# EAGLE design Smart Fan Controler (EAGLE 9.2.0)

## Sheet 1 of 3
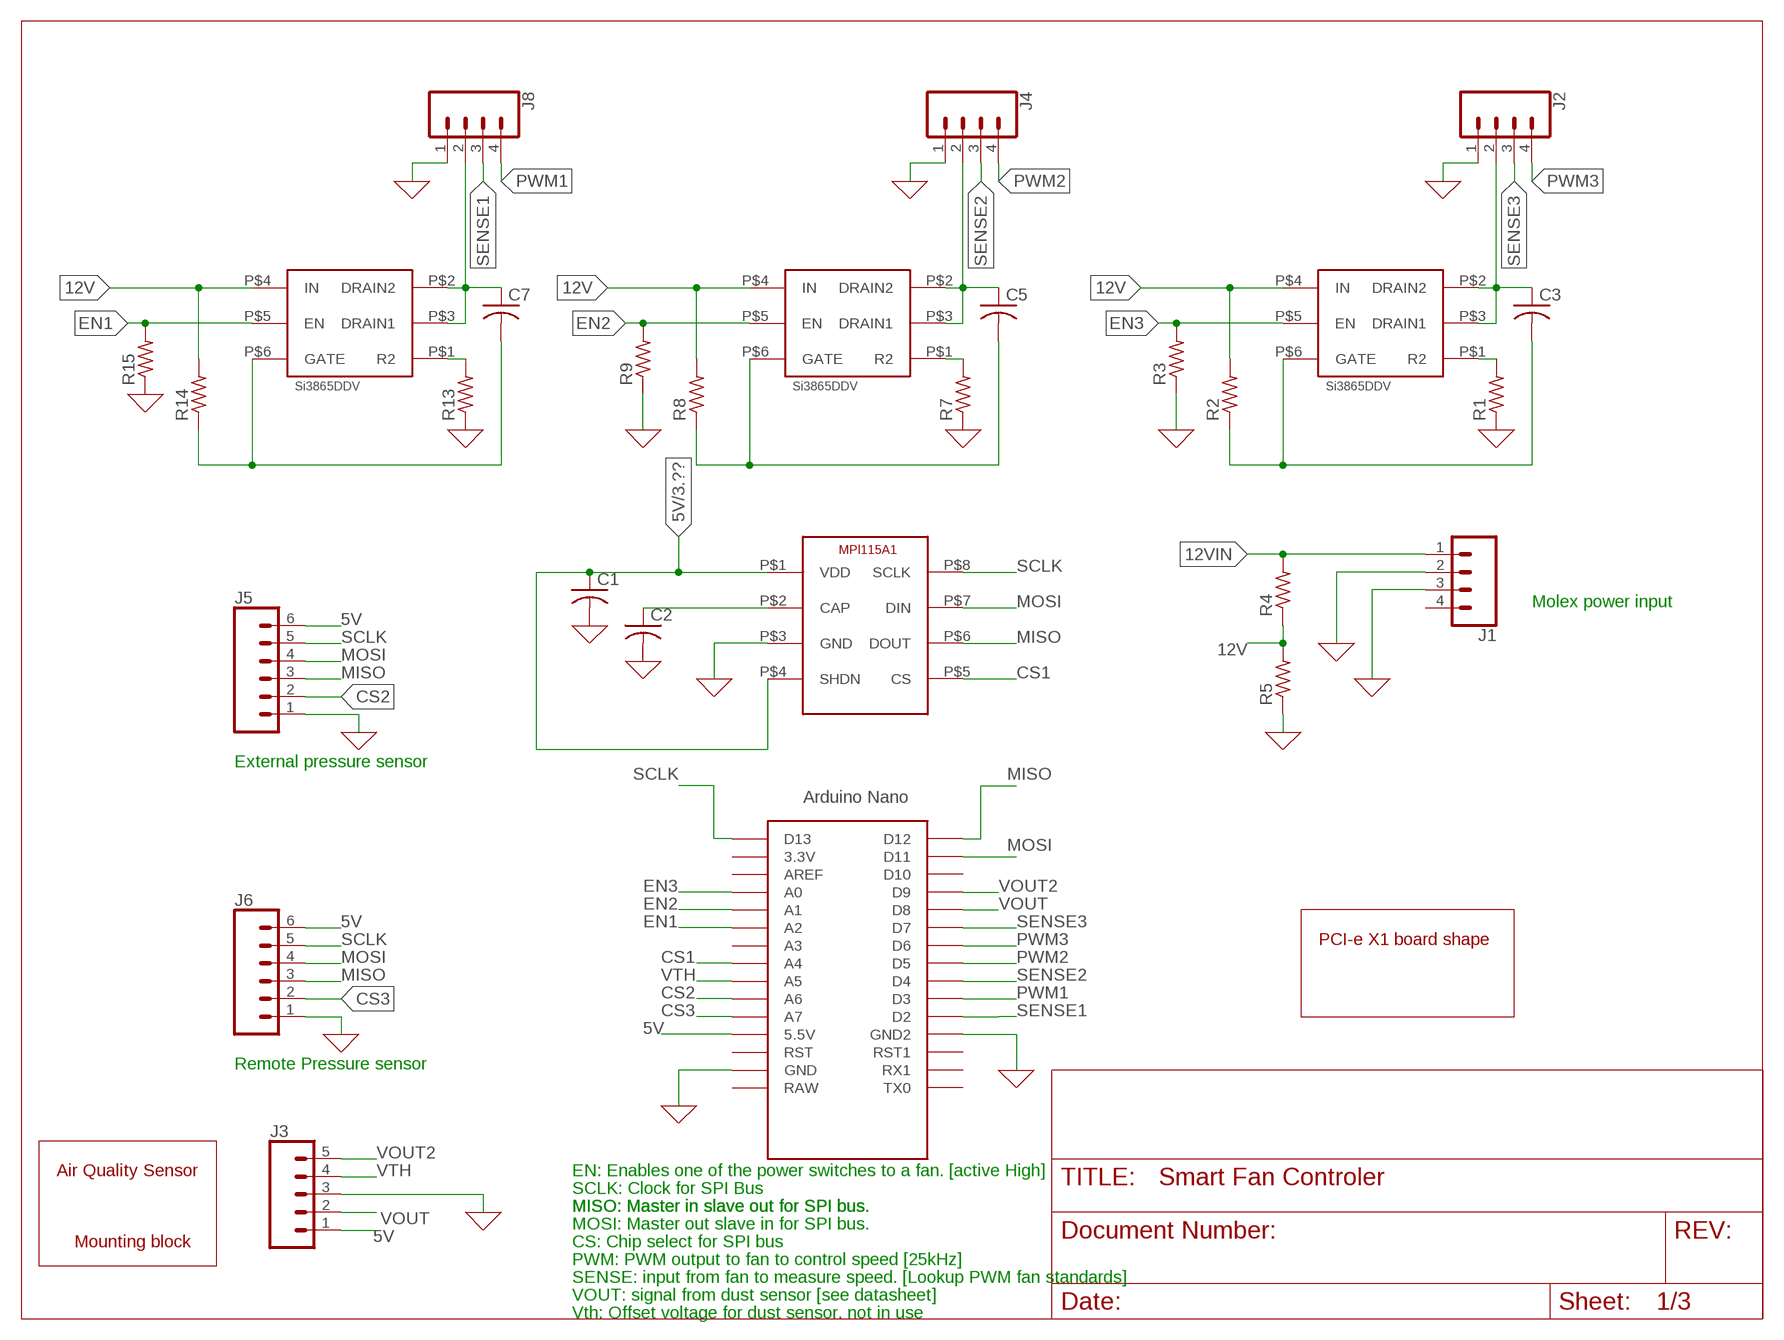
[diagram p0: schematic, sheet 1]

### Parts
C1  C-USC0805  [C0805]
C2  C-USC0805  [C0805]
C3  C-USC0805  [C0805]
C5  C-USC0805  [C0805]
C7  C-USC0805  [C0805]
J1  CONN_04MOLEX_FAN_HEADER  [MOLEX_FAN_HEADER]
J2  CONN_04MOLEX_FAN_HEADER  [MOLEX_FAN_HEADER]
J3  CONN_05NO_SILK  [1X05_NO_SILK]
J4  CONN_04MOLEX_FAN_HEADER  [MOLEX_FAN_HEADER]
J5  CONN_06LOCK_LONGPADS  [1X06_LOCK_LONGPADS]
J6  CONN_06LOCK_LONGPADS  [1X06_LOCK_LONGPADS]
J8  CONN_04MOLEX_FAN_HEADER  [MOLEX_FAN_HEADER]
R1  R-US_R0805  [R0805]
R2  R-US_R0805  [R0805]
R3  R-US_R0805  [R0805]
R4  R-US_R0805  [R0805]
R5  R-US_R0805  [R0805]
R7  R-US_R0805  [R0805]
R8  R-US_R0805  [R0805]
R9  R-US_R0805  [R0805]
R13  R-US_R0805  [R0805]
R14  R-US_R0805  [R0805]
R15  R-US_R0805  [R0805]
U$1  MPL115A1  [MPL115A1]
U$2  NANO  [NANO]
U$3  SI3865DDV  [TSOP-6]
U$4  AIR_QUALITY_SENSOR  [AIR_SENSOR]
U$5  SI3865DDV  [TSOP-6]
U$8  SI3865DDV  [TSOP-6]

### Nets
0: C1.2 C2.2 J1.2 J1.3 J2.1 J3.3 J4.1 J5.1 J6.1 J8.1 R1.1 R3.1 R5.1 R7.1 R9.1 R13.1 R15.1 U$1.P$3(GND) U$2.GND U$2.GND1(GND2) ; supply symbol labelled GND ; also sheet 3
5V: C1.1 J3.1 J5.6 J6.6 U$1.P$1(VDD) U$1.P$4(SHDN) U$2.5V(5.5V) ; also sheet 3
12V: R2.2 R4.1 R5.2 R8.2 R14.2 U$3.P$4(IN) U$5.P$4(IN) U$8.P$4(IN)
12VIN: J1.1 R4.2
CS1: U$1.P$5(CS) U$2.A4
CS2: J5.2 U$2.A6
CS3: J6.2 U$2.A7
EN1: R15.2 U$2.A2 U$8.P$5(EN)
EN2: R9.2 U$2.A1 U$5.P$5(EN)
EN3: R3.2 U$2.A0 U$3.P$5(EN)
MISO: J5.3 J6.3 U$1.P$6(DOUT) U$2.D12 ; also sheet 3
MOSI: J5.4 J6.4 U$1.P$7(DIN) U$2.D11 ; also sheet 3
N$1: C2.1 U$1.P$2(CAP)
N$2: R1.2 U$3.P$1(R2)
N$10: R7.2 U$5.P$1(R2)
N$11: C3.1 J2.2 U$3.P$2(DRAIN2) U$3.P$3(DRAIN1)
N$19: C3.2 R2.1 U$3.P$6(GATE)
N$20: C5.1 J4.2 U$5.P$2(DRAIN2) U$5.P$3(DRAIN1)
N$21: C5.2 R8.1 U$5.P$6(GATE)
N$25: R13.2 U$8.P$1(R2)
N$26: C7.1 J8.2 U$8.P$2(DRAIN2) U$8.P$3(DRAIN1)
N$27: C7.2 R14.1 U$8.P$6(GATE)
PWM1: J8.4 U$2.D3
PWM2: J4.4 U$2.D5
PWM3: J2.4 U$2.D6
SCLK: J5.5 J6.5 U$1.P$8(SCLK) U$2.D13 ; also sheet 3
SENSE1: J8.3 U$2.D2
SENSE2: J4.3 U$2.D4
SENSE3: J2.3 U$2.D7
VOUT: J3.2 U$2.D8
VOUT2: J3.5 U$2.D9
VTH: J3.4 U$2.A5
Unconnected: J1.4 U$2.3.3V U$2.A3 U$2.AREF U$2.D10 U$2.ICSP1 U$2.ICSP2 U$2.ICSP3 U$2.ICSP4 U$2.ICSP5 U$2.ICSP6 U$2.RAW U$2.RST U$2.RST1 U$2.RX1 U$2.TX0

### Notes on the sheet
- Molex power input
- External pressure sensor
- PCI-e X1 board shape
- Remote Pressure sensor
- EN: Enables one of the power switches to a fan. [active High]
- SCLK: Clock for SPI Bus
- MISO: Master in slave out for SPI bus. | MISO: Master in slave out for SPI bus.
- MOSI: Master out slave in for SPI bus.
- CS: Chip select for SPI bus
- PWM: PWM output to fan to control speed [25kHz]
- SENSE: input from fan to measure speed. [Lookup PWM fan standards]
- VOUT: signal from dust sensor [see datasheet]
- Vth: Offset voltage for dust sensor. not in use

## Sheet 2 of 3

## Sheet 3 of 3
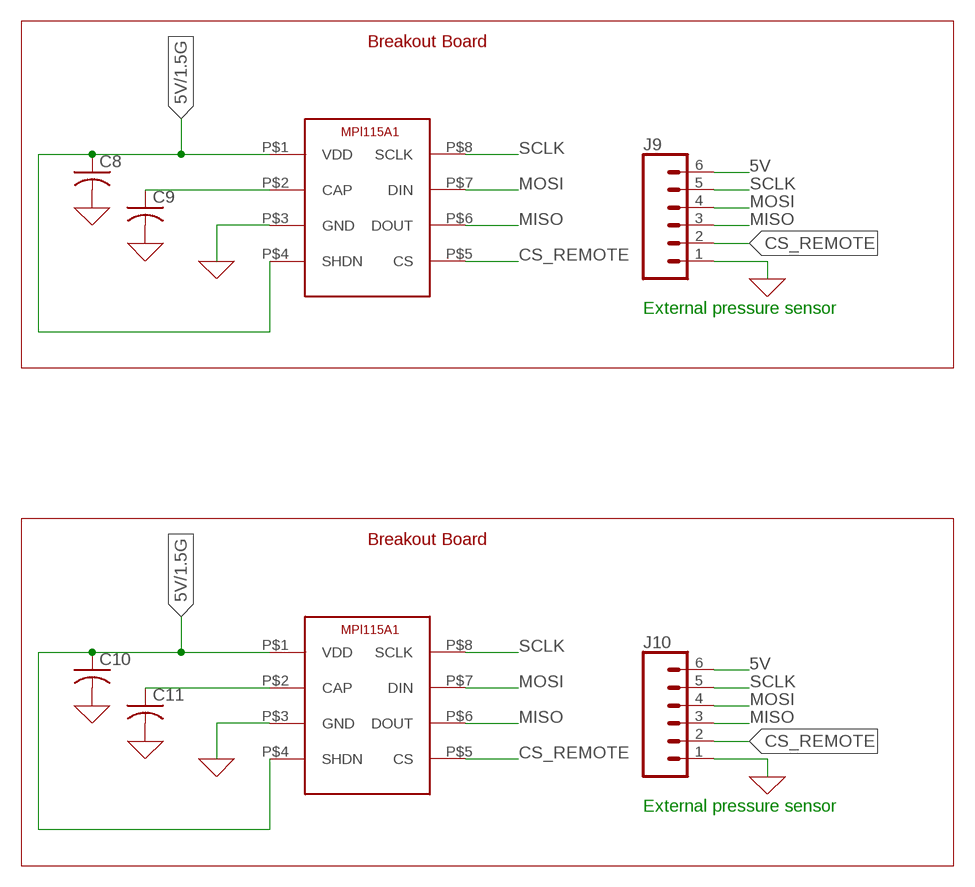
[diagram p1: schematic, sheet 3]

### Parts
C8  C-USC0805  [C0805]
C9  C-USC0805  [C0805]
C10  C-USC0805  [C0805]
C11  C-USC0805  [C0805]
J9  CONN_06LOCK_LONGPADS  [1X06_LOCK_LONGPADS]
J10  CONN_06LOCK_LONGPADS  [1X06_LOCK_LONGPADS]
U$7  MPL115A1  [MPL115A1]
U$9  MPL115A1  [MPL115A1]

### Nets
0: C8.2 C9.2 C10.2 C11.2 J9.1 J10.1 U$7.P$3(GND) U$9.P$3(GND) ; supply symbol labelled GND ; also sheet 1
5V: C8.1 C10.1 J9.6 J10.6 U$7.P$1(VDD) U$7.P$4(SHDN) U$9.P$1(VDD) U$9.P$4(SHDN) ; also sheet 1
CS_REMOTE: J9.2 J10.2 U$7.P$5(CS) U$9.P$5(CS)
MISO: J9.3 J10.3 U$7.P$6(DOUT) U$9.P$6(DOUT) ; also sheet 1
MOSI: J9.4 J10.4 U$7.P$7(DIN) U$9.P$7(DIN) ; also sheet 1
N$4: C9.1 U$7.P$2(CAP)
N$5: C11.1 U$9.P$2(CAP)
SCLK: J9.5 J10.5 U$7.P$8(SCLK) U$9.P$8(SCLK) ; also sheet 1

### Notes on the sheet
- Breakout Board
- External pressure sensor
- Breakout Board
- External pressure sensor

## Library data of the parts
C1-C3 C5 C7-C11 = rcl:C-US: CAPACITOR, American symbol; SPICEPREFIX: C
J1 J2 J4 J8 = Smart fan:CONN_04: Multi connection point. Often used as Generic Header-pin footprint for 0.1 inch spaced/style header connections On any of the 0.1 inch spaced packages, you can populate with these: Break Away Headers - Straight <https://www.sparkfun.com/products/116> (PRT-00116) Break Away Male Headers - Right Angle <https://www.sparkfun.com/products/553> (PRT-00553) Female Headers <https://www.sparkfun.com/products/115> (PRT-00115) Break Away Headers - Machine Pin <https://www.sparkfun.com/products/117> (PRT-00117) Break Away Female Headers - Swiss Machine Pin <https://www.sparkfun.com/products/743> (PRT-00743) For SCREWTERMINALS and SPRING TERMINALS visit here: Screw Terimnals on SparkFun.com <https://www.sparkfun.com/search/results?term=Screw+Terminals> (5mm/3.5mm/2.54mm spacing) This device is also useful as a general connection point to wire up your design to another part of your project. Our various solder wires solder well into these plated through hole pads. Hook-Up Wire - Assortment (Stranded, 22 AWG) <https://www.sparkfun.com/products/11375> (PRT-11375) Hook-Up Wire - Assortment (Solid Core, 22 AWG) <https://www.sparkfun.com/products/11367> (PRT-11367) View the entire wire category on our website here <https://www.sparkfun.com/categories/141> Special notes: Molex polarized connector foot print use with SKU : PRT-08231 with associated crimp pins and housings. 1MM SMD Version SKU: PRT-10208
J3 = SparkFun-Connectors:CONN_05: Multi connection point. Often used as Generic Header-pin footprint for 0.1 inch spaced/style header connections On any of the 0.1 inch spaced packages, you can populate with these: Break Away Headers - Straight <https://www.sparkfun.com/products/116> (PRT-00116) Break Away Male Headers - Right Angle <https://www.sparkfun.com/products/553> (PRT-00553) Female Headers <https://www.sparkfun.com/products/115> (PRT-00115) Break Away Headers - Machine Pin <https://www.sparkfun.com/products/117> (PRT-00117) Break Away Female Headers - Swiss Machine Pin <https://www.sparkfun.com/products/743> (PRT-00743) For SCREWTERMINALS and SPRING TERMINALS visit here: Screw Terimnals on SparkFun.com <https://www.sparkfun.com/search/results?term=Screw+Terminals> (5mm/3.5mm/2.54mm spacing) This device is also useful as a general connection point to wire up your design to another part of your project. Our various solder wires solder well into these plated through hole pads. Hook-Up Wire - Assortment (Stranded, 22 AWG) <https://www.sparkfun.com/products/11375> (PRT-11375) Hook-Up Wire - Assortment (Solid Core, 22 AWG) <https://www.sparkfun.com/products/11367> (PRT-11367) View the entire wire category on our website here <https://www.sparkfun.com/categories/141> Special notes: Molex polarized connector foot print use with SKU : PRT-08231 with associated crimp pins and housings. 1MM SMD Version SKU: PRT-10208
J5 J6 J9 J10 = SparkFun-Connectors:CONN_06: Multi connection point. Often used as Generic Header-pin footprint for 0.1 inch spaced/style header connections On any of the 0.1 inch spaced packages, you can populate with these: Break Away Headers - Straight <https://www.sparkfun.com/products/116> (PRT-00116) Break Away Male Headers - Right Angle <https://www.sparkfun.com/products/553> (PRT-00553) Female Headers <https://www.sparkfun.com/products/115> (PRT-00115) Break Away Headers - Machine Pin <https://www.sparkfun.com/products/117> (PRT-00117) Break Away Female Headers - Swiss Machine Pin <https://www.sparkfun.com/products/743> (PRT-00743) Arduino Stackable Header - 6 Pin <https://www.sparkfun.com/products/9280> (PRT-09280) For SCREWTERMINALS and SPRING TERMINALS visit here: Screw Terimnals on SparkFun.com <https://www.sparkfun.com/search/results?term=Screw+Terminals> (5mm/3.5mm/2.54mm spacing) This device is also useful as a general connection point to wire up your design to another part of your project. Our various solder wires solder well into these plated through hole pads. Hook-Up Wire - Assortment (Stranded, 22 AWG) <https://www.sparkfun.com/products/11375> (PRT-11375) Hook-Up Wire - Assortment (Solid Core, 22 AWG) <https://www.sparkfun.com/products/11367> (PRT-11367) View the entire wire category on our website here <https://www.sparkfun.com/categories/141>
R1-R5 R7-R9 R13-R15 = rcl:R-US_: RESISTOR, American symbol; SPICEPREFIX: R
U$1 U$7 U$9 = Smart fan:MPL115A1
U$2 = Smart fan:NANO: Arduino Nano
U$3 U$5 U$8 = DubSat1 Components:SI3865DDV
U$4 = Smart fan:AIR_QUALITY_SENSOR

## Board
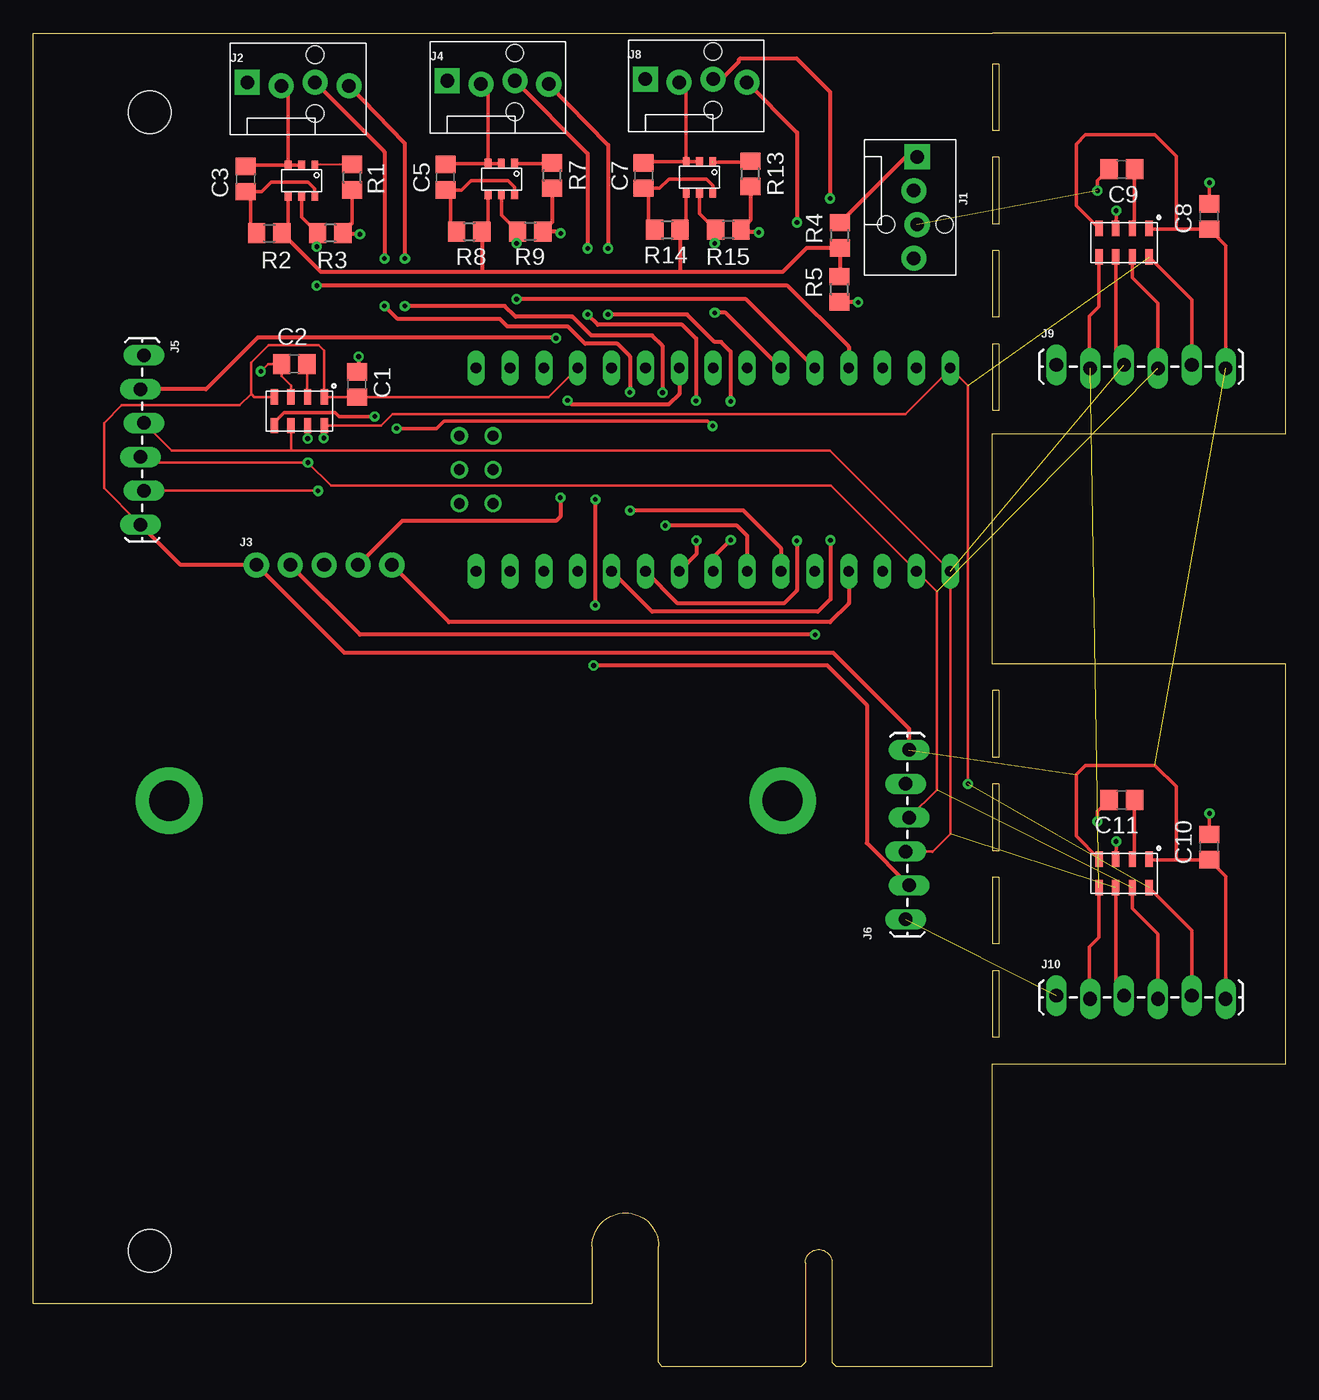
[diagram p2: board, top side]
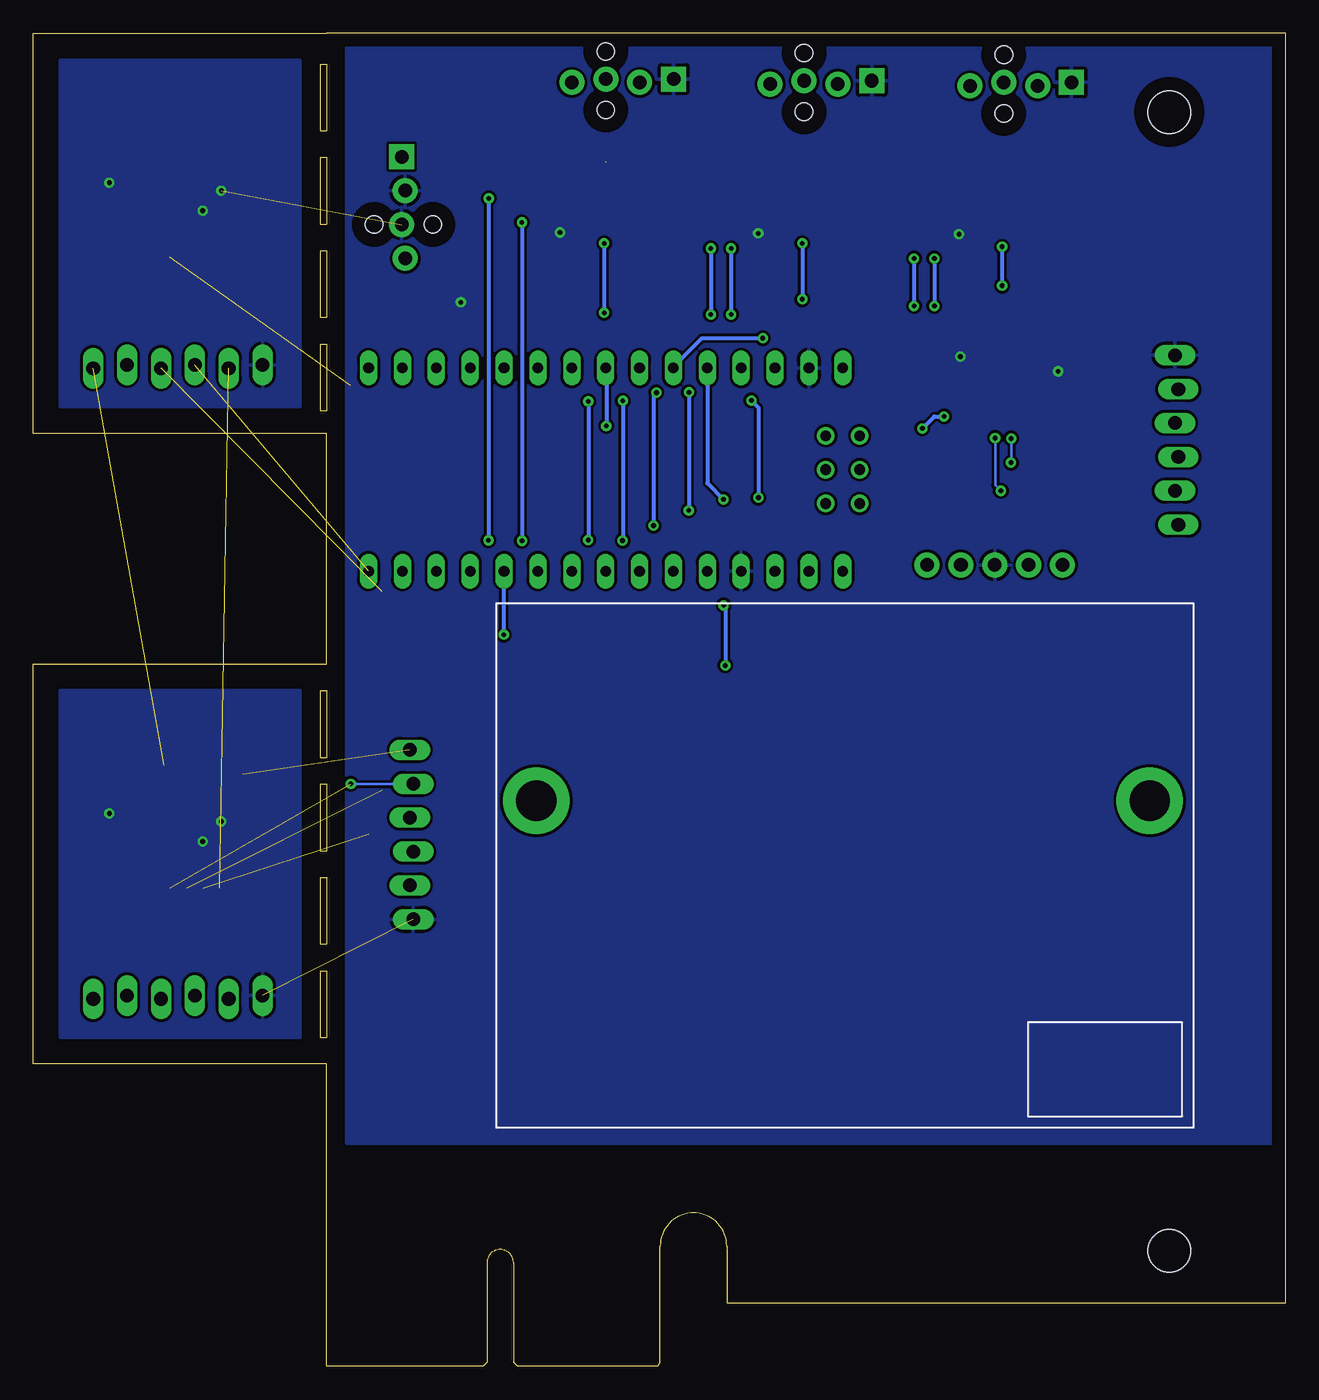
[diagram p3: board, bottom side, seen from below]

Size 93.91 x 99.95 mm. Coordinates in mm from the lower left corner, seen from the top.
Outline: 0,4.7 0,99.95 71.91,99.95 93.91,99.95 93.91,69.95 71.91,69.95 71.91,52.66 93.91,52.66 93.91,22.65 71.91,22.65 71.91,0 60.2,0 59.9,0.3 59.9,7.75 arc180 57.9,7.75 57.9,0.3 57.6,0 47.1,0 46.9,0.3 46.9,9 arc90 44.4,11.5 arc90 41.9,9 41.9,4.7 0,4.7
Outline: 0,4.7 0,4.7
Outline: 72.41,29.65 72.41,24.65 71.91,24.65 71.91,29.65 72.41,29.65
Outline: 72.41,36.66 72.41,31.65 71.91,31.65 71.91,36.66 72.41,36.66
Outline: 72.41,43.66 72.41,38.66 71.91,38.66 71.91,43.66 72.41,43.66
Outline: 72.41,50.66 72.41,45.66 71.91,45.66 71.91,50.66 72.41,50.66
Outline: 72.41,76.66 72.41,71.66 71.91,71.66 71.91,76.66 72.41,76.66
Outline: 72.41,83.66 72.41,78.66 71.91,78.66 71.91,83.66 72.41,83.66
Outline: 72.41,90.66 72.41,85.66 71.91,85.66 71.91,90.66 72.41,90.66
Outline: 72.41,97.66 72.41,92.66 71.91,92.66 71.91,97.66 72.41,97.66
Copper layers (1*16): Top 0.035mm / dielectric 1.5mm / Bottom 0.035mm
Design rules "default *": minimum track width 6mil, minimum drill 0.35mm, track to track 8mil, track to pad 8mil, pad to pad 6mil, via to via 6mil, smd to smd 6mil, copper to edge 40mil, drill to drill 6mil, minimum pad ring 10mil, minimum via ring 8mil, stop-mask expansion 4mil, vias tented up to drill 0mil, thermal gap 10mil
Holes 3.2 mm at 8.72,8.66 8.72,94.06

### Footprints (pad centres in the part's own frame; a part is rotated, then mirrored left to right if it is on the bottom)
C0805 = smd 1.3 x 1.5: 1 -0.95,0; 2 0.95,0
MOLEX_FAN_HEADER = drill 1.016 pad 1.88 square: 1 0,0.127 | drill 1.016 pad 1.88: 2 2.54,-0.127; 3 5.08,0.127; 4 7.62,-0.127 | hole 1.3: 5.08,2.2; 5.08,-2.2
1X05_NO_SILK = drill 1.016 pad 1.88: 1 0,0; 2 2.54,0; 3 5.08,0; 4 7.62,0; 5 10.16,0
1X06_LOCK_LONGPADS = drill 1.016 long: 1 0,0; 2 2.54,-0.254; 3 5.08,0; 4 7.62,-0.254; 5 10.16,0; 6 12.7,-0.254
R0805 = smd 1.3 x 1.5: 1 -0.95,0; 2 0.95,0
MPL115A1 = smd 1.15 x 0.55: P$1 -1.075,1.875; P$2 -1.075,0.625; P$3 -1.075,-0.625; P$4 -1.075,-1.875; P$5 1.075,-1.875; P$6 1.075,-0.625; P$7 1.075,0.625; P$8 1.075,1.875
NANO = drill 0.8 long: 3.3V -10.16,24.13; 5V -10.16,-1.27; A0 -10.16,19.05; A1 -10.16,16.51; A2 -10.16,13.97; A3 -10.16,11.43; A4 -10.16,8.89; A5 -10.16,6.35; A6 -10.16,3.81; A7 -10.16,1.27; AREF -10.16,21.59; D2 5.08,1.27; D3 5.08,3.81; D4 5.08,6.35; D5 5.08,8.89; D6 5.08,11.43; D7 5.08,13.97; D8 5.08,16.51; D9 5.08,19.05; D10 5.08,21.59; D11 5.08,24.13; D12 5.08,26.67; D13 -10.16,26.67; GND -10.16,-6.35; GND1 5.08,-1.27; RAW -10.16,-8.89; RST -10.16,-3.81; RST1 5.08,-3.81; RX1 5.08,-6.35; TX0 5.08,-8.89 | drill 0.8: ICSP1 -5.08,-10.16; ICSP2 -5.08,-7.62; ICSP3 -2.54,-10.16; ICSP4 -2.54,-7.62; ICSP5 0,-10.16; ICSP6 0,-7.62
TSOP-6 = smd 0.508 x 0.7: P$1 -1,-1.162; P$2 0,-1.162; P$3 1,-1.162; P$4 1,1.162; P$5 0,1.162; P$6 -1,1.162
AIR_SENSOR = drill 3 pad 5: P$1 3,24.5; P$2 49,24.5

### Placement (x,y rotation side)
C1  24.28,73.63 90 top
C2  19.57,75.16 180 top
C3  15.92,89.03 270 top
C5  30.91,89.16 270 top
C7  45.77,89.29 270 top
C8  88.18,86.22 90 top
C9  81.63,89.76 180 top
C10  88.18,38.93 90 top
C11  81.63,42.47 180 top
J1  66.15,90.7 270 top
J2  16.05,96.14 0 top
J3  16.73,60.09 0 top
J4  31.04,96.27 0 top
J5  8.3,75.81 270 top
J6  65.42,33.52 90 top
J8  45.89,96.4 0 top
J9  76.72,75.09 0 top
J10  76.72,27.79 0 top
R1  23.92,89.16 90 top
R2  17.7,84.97 0 top
R3  22.27,84.97 180 top
R4  60.48,84.81 90 top
R5  60.46,80.76 90 top
R7  38.91,89.29 90 top
R8  32.69,85.09 0 top
R9  37.26,85.09 180 top
R13  53.77,89.41 90 top
R14  47.55,85.22 0 top
R15  52.12,85.22 180 top
U$1  19.95,71.61 270 top
U$2  42.1,64.7 270 top
U$3  20.11,88.91 180 top
U$4  59.19,17.9 0 bottom
U$5  35.1,89.03 180 top
U$7  81.8,84.25 270 top
U$8  49.96,89.16 180 top
U$9  81.8,36.96 270 top

### Tracks (layer width: path | path; a pad name or v marks a point on that pad's centre or on a via)
0  (via drill 0.35)  (2 unrouted)
  Top 0.2: U$1.P$3 19.32,73.53 18.62,74.24 C2.2 17.62,75.16 v17.06,74.61
  Top 0.254: R3.1 arc-90 23.92,85.67 R1.1 | C8.2 88.18,88.75 v88.21,88.75 | C9.2 79.81,88.89 v79.81,88.15 | v81.21,86.65 U$7.P$3 | C10.2 88.18,41.46 v88.21,41.46 | C11.2 79.81,41.6 v79.81,40.86 | v81.21,39.36 U$9.P$3
  Top 0.305: R13.1 53.77,85.92 R15.1 53.26,85.03 v54.41,85.03 | R7.1 38.91,85.8 R9.1 39.41,85.09 v39.55,84.95 | R3.1 23.29,84.89 v24.49,84.89 | R5.1 60.48,79.78 v61.85,79.78 | C1.2 24.39,74.69 v24.39,75.72
  pour Bottom: -2.11,101.1 70.41,101.1 70.41,16.71 -2.11,16.71
  pour Bottom: 73.91,71.95 91.91,71.95 91.91,97.95 73.91,97.95
  pour Bottom: 73.91,24.65 91.91,24.65 91.91,50.66 73.91,50.66
5V  (2 unrouted)
  Top 0.2: U$2.5V 38.65,72.68 C1.1 21.85,72.68 21.84,72.68 U$1.P$1 21.82,76.14 21.41,76.56 17.64,76.56 16.34,75.26 16.34,72.92 | 16.34,72.92 16.34,72.87 16.36,72.89 16.56,72.68 U$1.P$4 | J5.6 7.84,63.31 5.3,65.85 5.3,70.72 6.64,72.06 15.48,72.06 16.34,72.92
  Top 0.254: J9.6 89.42,84.03 C8.1 85.81,85.27 | 85.81,85.27 83.73,85.27 U$7.P$1 | U$7.P$4 78.21,87.04 78.21,91.65 78.91,92.35 84.11,92.35 85.71,90.75 85.71,85.37 85.81,85.27 | J10.6 89.42,36.73 C10.1 85.81,37.98 | 85.81,37.98 83.73,37.98 U$9.P$1 | U$9.P$4 78.21,39.75 78.21,44.36 78.91,45.05 84.11,45.05 85.71,43.46 85.71,38.08 85.81,37.98
  Top 0.305: 7.84,63.31 11.06,60.09 J3.1 23.33,53.48 60,53.48 65.68,47.81 J6.6
12V
  Top 0.203: 19.11,85.43 arc90 R2.2 | 34.1,85.56 arc90 R8.2 | 48.96,85.69 arc90 R14.2
  Top 0.254: U$3.P$4 19.11,85.43 | U$5.P$4 34.1,85.56 | U$8.P$4 48.96,85.69
  Top 0.305: 48.56,82.05 56.18,82.05 57.99,83.86 R4.1 60.48,81.73 R5.2 | 48.56,82.05 33.58,82.05 | 33.58,82.05 21.57,82.05 R2.2 | R14.2 48.49,82.11 48.56,82.05 | R8.2 33.64,82.11 33.58,82.05
12VIN
  Top 0.305: R4.2 65.42,90.7 J1.1
CS1  (via drill 0.35)
  Top 0.254: U$1.P$5 18.07,70.75 18.82,71.51 22.64,71.51 22.92,71.23 v25.61,71.23 | v27.24,70.33 30.24,70.33 30.79,70.88 50.57,70.88 v50.94,70.51
  Bottom 0.305: v25.61,71.23 26.34,71.23 v27.24,70.33 | v50.94,70.51 50.94,74.81 U$2.A4
CS2  (via drill 0.35)
  Top 0.305: J5.2 12.96,73.27 16.84,77.14 39.15,77.14 v39.2,77.09
  Bottom 0.305: v39.2,77.09 43.77,77.09 45.91,74.95 U$2.A6
CS3  (via drill 0.35)
  Top 0.305: J6.2 62.51,39.22 62.51,49.59 59.55,52.55 v42.01,52.55 | v42.14,57.05 42.14,64.98 v42.15,65
  Bottom 0.305: v42.01,52.55 42.01,56.93 v42.14,57.05 | v42.15,65 43.37,66.21 U$2.A7
CS_REMOTE  (1 unrouted)
  Top 0.254: U$7.P$5 79.92,79.47 79.21,78.75 79.21,74.89 J9.2 | U$9.P$5 79.92,32.17 79.21,31.45 79.21,27.59 J10.2
EN1  (via drill 0.35)
  Top 0.254: R15.2 49.96,86.43 U$8.P$5
  Top 0.305: R15.2 51.17,84.27 v51.1,84.21 | v51.1,79 51.92,79 U$2.A2
  Bottom 0.305: v51.1,84.21 v51.1,79
EN2  (via drill 0.35)
  Top 0.254: R9.2 35.1,86.3 U$5.P$5
  Top 0.305: R9.2 36.31,84.27 v36.24,84.21 | U$2.A1 53.45,80.02 v36.24,80.02
  Bottom 0.305: v36.24,84.21 v36.24,80.02
EN3  (via drill 0.35)
  Top 0.254: R3.2 20.11,86.18 U$3.P$5
  Top 0.305: R3.2 21.26,84.9 v21.26,83.95 | v21.26,81.03 56.57,81.03 61.15,76.46 U$2.A0
  Bottom 0.305: v21.26,83.95 v21.26,81.03
MISO  (2 unrouted)
  Top 0.2: J5.3 10.37,68.66 19.35,68.66 | 19.35,68.66 59.73,68.66 U$2.D12 68.77,39.91 67.43,38.58 67.41,38.6 J6.3 | 19.35,68.66 19.35,70.51 U$1.P$6
  Top 0.254: U$7.P$6 81.17,75.72 J9.3 | U$9.P$6 81.17,28.42 J10.3
MOSI  (via drill 0.35)  (2 unrouted)
  Top 0.2: J5.4 8.47,67.76 v20.59,67.76 22.32,66.03 59.81,66.03 U$2.D11 67.76,58.08 67.76,43.22 J6.4 | U$1.P$7 v20.57,69.57 v20.57,69.56
  Top 0.254: U$7.P$7 82.42,81.64 84.34,79.72 J9.4 | U$9.P$7 82.42,34.34 84.34,32.43 J10.4
  Bottom 0.2: v20.57,69.56 20.57,67.78 v20.59,67.76
N$1
  Top 0.2: C2.1 20.52,72.74 U$1.P$2
N$2
  Top 0.152: R1.2 21.15,90.11 U$3.P$1
  Top 0.254: R1.2 23.88,90.07
N$4
  Top 0.254: U$7.P$2 82.58,85.48 C9.1
N$5
  Top 0.254: U$9.P$2 82.58,38.19 C11.1
N$10
  Top 0.254: U$5.P$1 38.87,90.19 R7.2
N$11
  Top 0.203: 19.11,95.37 J2.2
  Top 0.254: U$3.P$2 U$3.P$3 | 19.11,95.37 U$3.P$3 | U$3.P$3 16.09,90.07 15.88,89.86 15.88,89.94 C3.1
N$19
  Top 0.254: R2.1 16.3,84.97 16.3,88.08 C3.2 17.13,88.08 17.83,88.78 20.62,88.78 21.11,88.29 U$3.P$6
N$20
  Top 0.203: 34.1,95.49 J4.2
  Top 0.254: U$5.P$2 U$5.P$3 | 34.1,95.49 U$5.P$3 | U$5.P$3 31.08,90.19 30.86,89.98 30.86,90.07 C5.1
N$21
  Top 0.254: R8.1 31.29,85.09 31.29,88.21 C5.2 32.12,88.21 32.81,88.91 35.61,88.91 36.1,88.41 U$5.P$6
N$25  (1 unrouted)
  Top 0.254: 50.96,90.3 53.7,90.3 R13.2
N$26
  Top 0.203: 48.96,95.62 J8.2
  Top 0.254: U$8.P$2 U$8.P$3 | 48.96,95.62 U$8.P$3 | U$8.P$3 45.94,90.32 45.72,90.11 45.72,90.19 C7.1
N$27
  Top 0.254: R14.1 46.15,85.22 46.15,88.34 C7.2 46.98,88.34 47.67,89.03 50.47,89.03 50.96,88.54 U$8.P$6
PWM1  (via drill 0.35)
  Top 0.305: U$2.D3 48.33,57.2 56.28,57.2 57.26,58.18 v57.26,61.9 | v57.27,85.78 57.27,92.52 J8.4
  Bottom 0.305: v57.26,61.9 57.26,85.77 v57.27,85.78
PWM2  (via drill 0.35)
  Top 0.305: J4.4 43.1,91.57 v43.1,83.83 | v43.1,78.87 49.02,78.87 51.09,76.81 51.58,76.81 52.29,76.09 v52.29,72.36 | v52.3,61.96 50.99,60.64 U$2.D5
  Bottom 0.305: v43.1,83.83 v43.1,78.87 | v52.29,72.36 v52.29,61.97 v52.3,61.96
PWM3  (via drill 0.35)
  Top 0.305: J2.4 27.86,91.7 v27.86,83.06 | v27.86,79.51 35.36,79.51 36.17,78.7 40.36,78.7 40.4,78.73 41.85,77.28 46.41,77.28 47.18,76.52 v47.18,73.02 | v47.4,63.04 52.77,63.04 53.53,62.28 U$2.D6
  Bottom 0.305: v27.86,83.06 v27.86,79.51 | v47.18,73.02 47.4,72.8 v47.4,63.04
SCLK  (via drill 0.35)  (2 unrouted)
  Top 0.2: J5.5 v21.35,65.65 v21.35,65.64 | v21.78,69.61 21.78,70.49 U$1.P$8 26.07,70.53 26.95,71.42 65.4,71.42 68.8,74.82 | v70.1,43.68 70.1,73.52 68.8,74.82 | 68.8,74.82 U$2.D13
  Top 0.254: U$7.P$8 86.88,79.97 J9.5 | U$9.P$8 86.88,32.68 J10.5
  Bottom 0.2: v21.35,65.64 21.78,66.08 v21.78,69.61 | v70.1,43.68 J6.5
SENSE1  (via drill 0.35)
  Top 0.305: U$2.D2 46.4,56.59 58.84,56.59 59.78,57.53 v59.78,61.94 | v59.75,87.58 59.75,95.56 57.26,98.06 53,98.06 52.89,97.95 52.89,97.8 51.61,96.53 J8.3
  Bottom 0.305: v59.78,61.94 59.78,87.55 v59.75,87.58
SENSE2  (via drill 0.35)
  Top 0.305: J4.3 41.58,90.94 v41.58,83.83 | v41.58,78.87 42.34,78.11 48.66,78.11 49.7,77.06 v49.7,72.39 | v49.72,61.92 49.72,60.89 U$2.D4
  Bottom 0.305: v41.58,83.83 v41.58,78.87 | v49.7,72.39 49.7,61.94 v49.72,61.92
SENSE3  (via drill 0.35)
  Top 0.305: J2.3 26.34,91.06 v26.34,83.06 | v26.34,79.51 27.32,78.53 34.99,78.53 35.55,77.97 40.09,77.97 41.38,76.67 43.81,76.67 44.74,75.75 v44.74,73.03 | v44.76,64.17 53.25,64.17 56.07,61.36 U$2.D7
  Bottom 0.305: v26.34,83.06 v26.34,79.51 | v44.74,73.03 44.74,64.2 v44.76,64.17
VOUT  (via drill 0.35)
  Top 0.305: J3.2 24.5,54.86 v58.63,54.86
  Bottom 0.305: v58.63,54.86 58.63,59.59 U$2.D8
VOUT2
  Top 0.305: J3.5 31.17,55.8 59.76,55.8 61.15,57.19 U$2.D9
VTH  (via drill 0.35)
  Top 0.305: J3.4 27.66,63.4 39.2,63.4 39.53,63.73 v39.53,65.14 | v40.06,72.42 40.37,72.12 47.65,72.12 48.45,72.91 U$2.A5
  Bottom 0.305: v39.53,65.14 39.53,71.89 v40.06,72.42